# EAGLE schematic main (EAGLE 6.3)
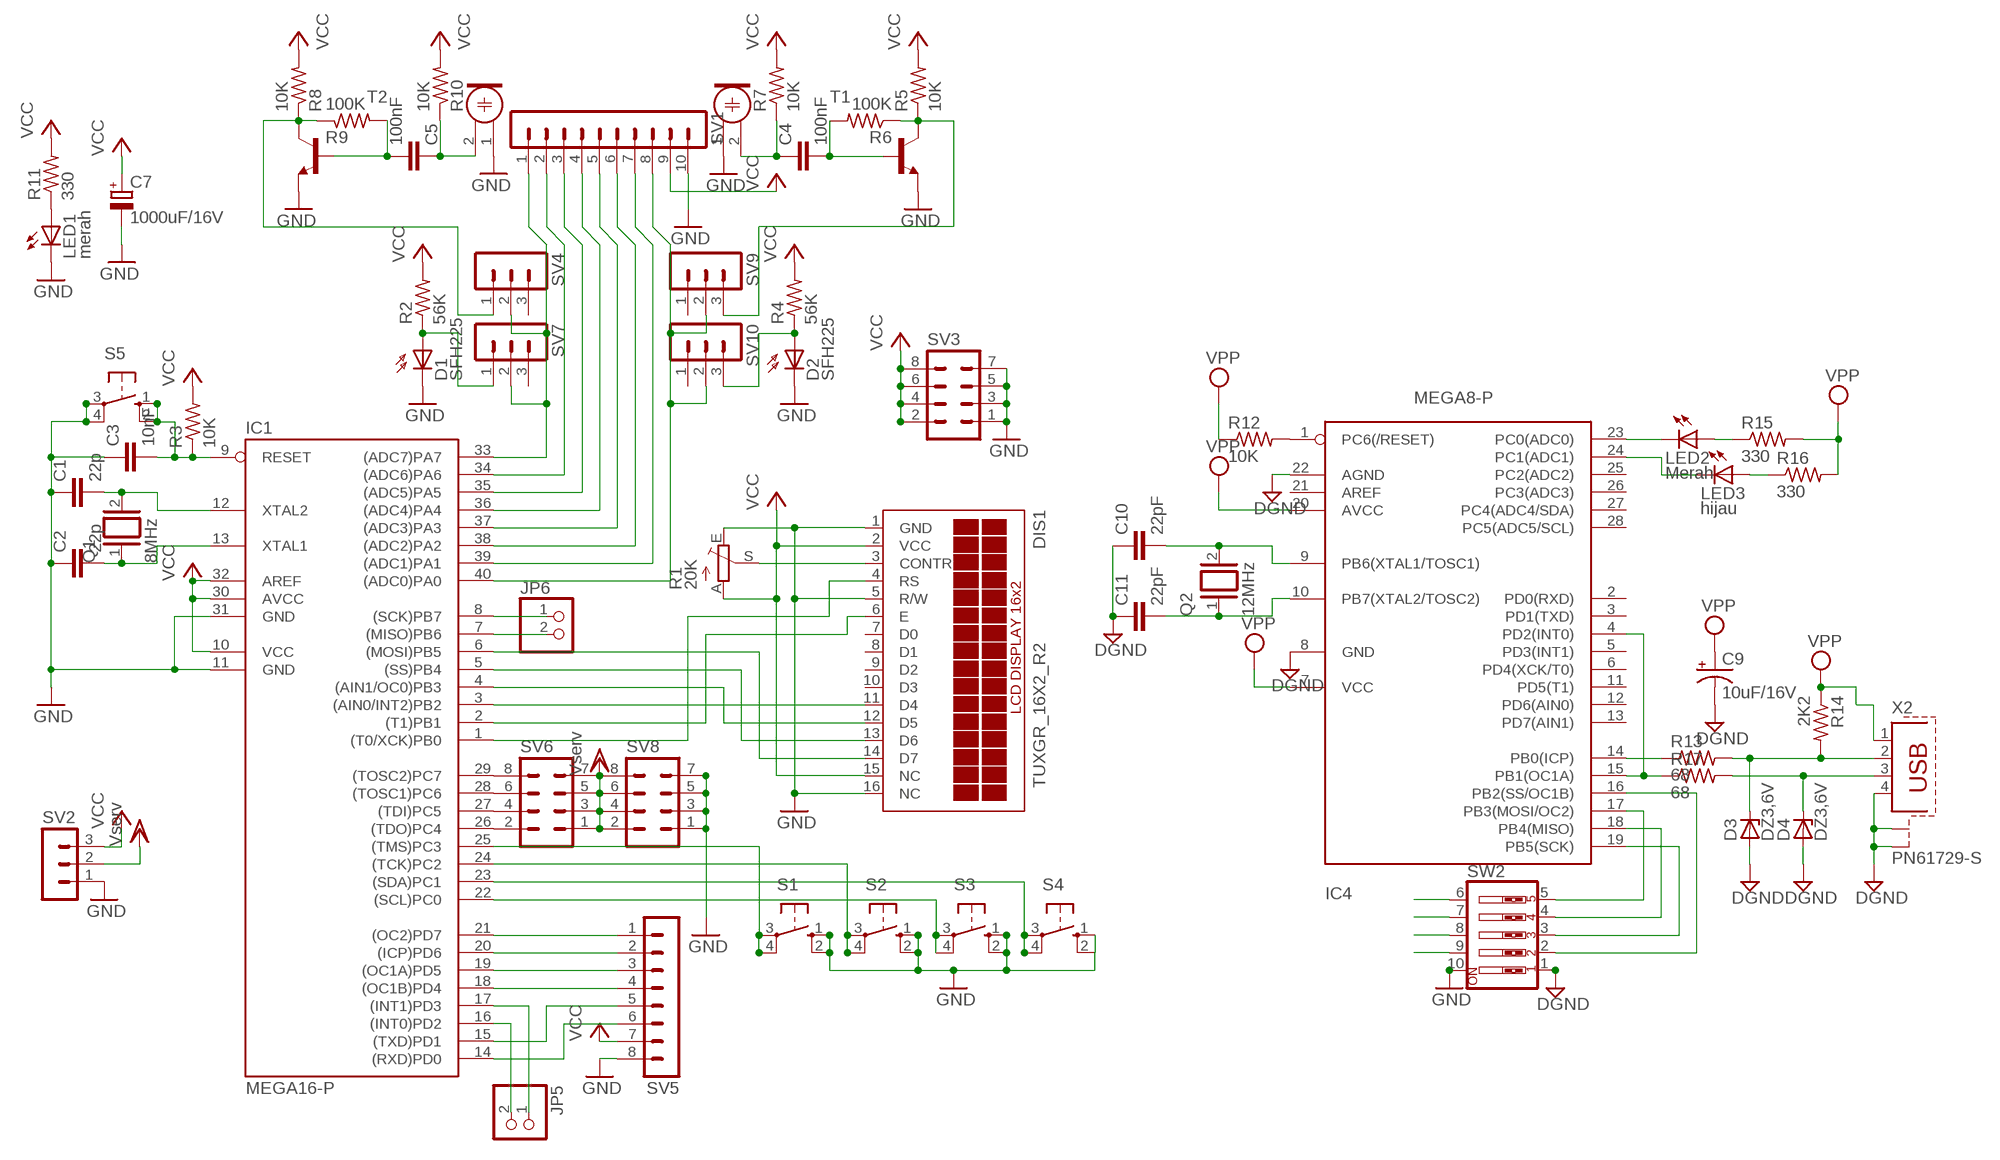
[diagram p0: schematic, sheet 1]

## Parts
C1  22p  C2,5-3  [C2.5-3]
C2  22p  C2,5-3  [C2.5-3]
C3  10nF  C2,5-3  [C2.5-3]
C4  100nF  C2,5-3  [C2.5-3]
C5  100nF  C2,5-3  [C2.5-3]
C7  1000uF/16V  CPOL-EUE5-10.5  [E5-10,5]
C9  10uF/16V  CPOL-USE2.5-5  [E2,5-5]
C10  22pF  C-EU025-024X044  [C025-024X044]
C11  22pF  C-EU025-024X044  [C025-024X044]
D1  SFH225  [SFH225]
D2  SFH225  [SFH225]
D3  DZ3,6V  ZENER-DIODEZD-5  [ZDIO-5]
D4  DZ3,6V  ZENER-DIODEZD-5  [ZDIO-5]
DIS1  TUXGR_16X2_R2  [TUXGR_16X2_R2]
IC1  MEGA16-P  [DIL40]
IC4  MEGA8-P  [DIL28-3]
JP5  PINHD-1X2  [1X02]
JP6  PINHD-1X2  [1X02]
LED1  merah  LED3MM  [LED3MM]
LED2  Merah  LED3MM  [LED3MM]
LED3  hijau  LED3MM  [LED3MM]
MICL  MC  ELECTRET_MICROPHON-F6050AP  [F6050AP]
MICR  MC  ELECTRET_MICROPHON-F6050AP  [F6050AP]
Q1  8MHz  XTAL/S  [QS]
Q2  12MHz  XTAL/S  [QS]
R1  20K  TRIM_EU-CA6V  [CA6V]
R2  56K  R-US_0207/10  [0207/10]
R3  10K  R-US_0207/10  [0207/10]
R4  56K  R-US_0207/10  [0207/10]
R5  10K  R-US_0207/10  [0207/10]
R6  100K  R-US_0207/10  [0207/10]
R7  10K  R-US_0207/10  [0207/10]
R8  10K  R-US_0207/10  [0207/10]
R9  100K  R-US_0207/10  [0207/10]
R10  10K  R-US_0207/10  [0207/10]
R11  330  R-US_0207/10  [0207/10]
R12  10K  R-US_0207/10  [0207/10]
R13  68  R-US_0207/10  [0207/10]
R14  2K2  R-US_0207/10  [0207/10]
R15  330  R-US_0207/10  [0207/10]
R16  330  R-US_0207/10  [0207/10]
R17  68  R-US_0207/10  [0207/10]
S1  10-XX  [B3F-10XX]
S2  10-XX  [B3F-10XX]
S3  10-XX  [B3F-10XX]
S4  10-XX  [B3F-10XX]
S5  10-XX  [B3F-10XX]
SV1  MA10-1  [MA10-1]
SV2  MA03-1  [MA03-1]
SV3  MA04-2  [MA04-2]
SV4  MA03-1  [MA03-1]
SV5  MA08-1W  [MA08-1W]
SV6  MA04-2  [MA04-2]
SV7  MA03-1  [MA03-1]
SV8  MA04-2  [MA04-2]
SV9  MA03-1  [MA03-1]
SV10  MA03-1  [MA03-1]
SW2  SW_DIP-5  [EDG-05]
T1  -NPN-TO92-EBC  [TO92-EBC]
T2  -NPN-TO92-EBC  [TO92-EBC]
X2  PN61729-S  [PN61729-S]

## Nets
DGND: C9.- C10.1 C11.1 D3.A D4.A IC4.8(GND) IC4.22(AGND) SW2.1 X2.4 X2.S1 X2.S2
GND: C1.1 C2.1 C3.1 C7.- D1.K(C) D2.K(C) DIS1.1(GND) DIS1.5(R/W) DIS1.16(NC) IC1.11(GND) IC1.31(GND) LED1.K(C) MICL.1 MICR.1 R1.E S1.1(S) S1.2(S1) S2.1(S) S2.2(S1) S3.1(S) S3.2(S1) S4.1(S) S4.2(S1) S5.3(P) S5.4(P1) SV1.10 SV2.1 SV3.1 SV3.3 SV3.5 SV3.7 SV5.8 SV8.1 SV8.3 SV8.5 SV8.7 SW2.10 T1.E T2.E
MISO: IC1.7((MISO)PB6) JP6.2 SW2.7
MOSI: DIS1.14(D7) IC1.6((MOSI)PB5) SW2.6
N$1: IC1.33((ADC7)PA7) SV1.1 SV4.2 SV7.2
N$2: IC1.34((ADC6)PA6) SV1.2
N$3: IC1.35((ADC5)PA5) SV1.3
N$4: IC1.36((ADC4)PA4) SV1.4
N$5: IC1.37((ADC3)PA3) SV1.5
N$6: IC1.38((ADC2)PA2) SV1.6
N$7: IC1.39((ADC1)PA1) SV1.7
N$8: D2.A R4.1 SV10.3
N$9: IC1.24((TCK)PC2) S2.3(P) S2.4(P1)
N$10: DIS1.13(D6) IC1.5((SS)PB4)
N$11: DIS1.12(D5) IC1.4((AIN1/OC0)PB3)
N$12: DIS1.11(D4) IC1.3((AIN0/INT2)PB2)
N$13: DIS1.6(E) IC1.2((T1)PB1)
N$14: R5.1 R6.1 SV9.3 T1.C
N$15: DIS1.3(CONTR) R1.S
N$16: C1.2 IC1.12(XTAL2) Q1.2
N$17: C2.2 IC1.13(XTAL1) Q1.1
N$18: DIS1.4(RS) IC1.1((T0/XCK)PB0)
N$19: D1.A R2.1 SV7.1
N$20: IC1.23((SDA)PC1) S4.3(P) S4.4(P1)
N$21: IC1.40((ADC0)PA0) SV1.8 SV9.2 SV10.2
N$22: C4.2 R6.2 T1.B
N$23: C4.1 MICL.2 R7.1
N$24: R8.1 R9.1 SV4.1 T2.C
N$25: C5.2 R9.2 T2.B
N$26: C5.1 MICR.2 R10.1
N$27: IC1.22((SCL)PC0) S3.3(P) S3.4(P1)
N$28: IC1.25((TMS)PC3) S1.3(P) S1.4(P1)
N$30: IC1.21((OC2)PD7) SV5.1
N$32: IC1.20((ICP)PD6) SV5.2
N$33: IC1.19((OC1A)PD5) SV5.3
N$34: IC1.18((OC1B)PD4) SV5.4
N$35: IC1.15((TXD)PD1) SV5.5
N$36: IC1.14((RXD)PD0) SV5.6
N$37: IC1.16((INT0)PD2) JP5.2
N$38: IC1.17((INT1)PD3) JP5.1
N$41: LED1.A R11.1
N$42: IC4.1(PC6(/RESET)) R12.2
N$44: IC1.26((TDO)PC4) SV6.2
N$45: IC1.27((TDI)PC5) SV6.4
N$46: IC1.28((TOSC1)PC6) SV6.6
N$47: IC1.29((TOSC2)PC7) SV6.8
N$51: C10.2 IC4.9(PB6(XTAL1/TOSC1)) Q2.2
N$52: C11.2 IC4.10(PB7(XTAL2/TOSC2)) Q2.1
N$53: IC4.14(PB0(ICP)) R13.1
N$55: LED2.A R15.1
N$56: LED3.A R16.1
N$57: IC4.23(PC0(ADC0)) LED2.K(C)
N$58: IC4.24(PC1(ADC1)) LED3.K(C)
N$59: D4.C R17.2 X2.3
N$67: IC4.4(PD2(INT0)) IC4.15(PB1(OC1A)) R17.1
N$69: D3.C R13.2 R14.2 X2.2
N$175: IC4.17(PB3(MOSI/OC2)) SW2.5
N$176: IC4.18(PB4(MISO)) SW2.4
N$177: IC4.19(PB5(SCK)) SW2.3
N$178: IC4.16(PB2(SS/OC1B)) SW2.2
RESET: C3.2 IC1.9(RESET) R3.1 S5.1(S) S5.2(S1) SW2.9
SCK: IC1.8((SCK)PB7) JP6.1 SW2.8
VCC: C7.+ DIS1.2(VCC) DIS1.15(NC) IC1.10(VCC) IC1.30(AVCC) IC1.32(AREF) R1.A R2.2 R3.2 R4.2 R5.2 R7.2 R8.2 R10.2 R11.2 SV1.9 SV2.3 SV3.2 SV3.4 SV3.6 SV3.8 SV5.7
VDD: SV2.2 SV6.1 SV6.3 SV6.5 SV6.7 SV8.2 SV8.4 SV8.6 SV8.8 ; supply symbol labelled Vserv
VPP: C9.+ IC4.7(VCC) IC4.20(AVCC) R12.1 R14.1 R15.2 R16.2 X2.1
Unconnected: DIS1.7(D0) DIS1.8(D1) DIS1.9(D2) DIS1.10(D3) IC4.2(PD0(RXD)) IC4.3(PD1(TXD)) IC4.5(PD3(INT1)) IC4.6(PD4(XCK/T0)) IC4.11(PD5(T1)) IC4.12(PD6(AIN0)) IC4.13(PD7(AIN1)) IC4.21(AREF) IC4.25(PC2(ADC2)) IC4.26(PC3(ADC3)) IC4.27(PC4(ADC4/SDA)) IC4.28(PC5(ADC5/SCL)) SV4.3 SV7.3 SV9.1 SV10.1

## Library data of the parts
C1-C5 = capacitor-wima:C: CAPACITOR naming: grid - package width
C7 = rcl:CPOL-EU: POLARIZED CAPACITOR, European symbol
C9 = rcl:CPOL-US: POLARIZED CAPACITOR, American symbol
C10 C11 = rcl:C-EU: CAPACITOR, European symbol
D1 D2 = opto-trans-siemens:SFH225: PHOTO DIODE; OC_FARNELL: unknown; OC_NEWARK: unknown
D3 D4 = diode:ZENER-DIODE: Z-Diode
DIS1 = display-lcd:TUXGR_16X2_R2: Tuxgraphics LCD display 16x2 characters reflective, without background light Source: tuxgr_12x2_r2.pdf; OC_FARNELL: unknown; OC_NEWARK: unknown
IC1 = atmel:MEGA16-P: MICROCONTROLLER 16 Kbytes FLASH 1 kbytes SRAM 512 bytes EEPROM USART 8-channel 10 bit ADC Source: avr.lbr; MPN: ATMEGA16-16PU; OC_FARNELL: 9171142; OC_NEWARK: 01M6885
IC4 = atmel:MEGA8-P: MICROCONTROLLER 8 Kbytes FLASH, 1 kbytes SRAM, 512 bytes EEPROM, USART, 4-channel 10 bit ADC, 2-channel 8 bit ADC Pin compatible with Atmega48, ATMega88, ATMega168 Source: avr.lbr
JP5 JP6 = pinhead:PINHD-1X2: PIN HEADER
LED1-LED3 = led:LED: LED OSRAM: - CHIPLED LG R971, LG N971, LY N971, LG Q971, LY Q971, LO R971, LY R971 LH N974, LH R974 LS Q976, LO Q976, LY Q976 LO Q996 - Hyper CHIPLED LW Q18S LB Q993, LB Q99A, LB R99A - SideLED LS A670, LO A670, LY A670, LG A670, LP A670 LB A673, LV A673, LT A673, LW A673 LH A674 LY A675 LS A676, LA A676, LO A676, LY A676, LW A676 LS A679, LY A679, LG A679 - Hyper Micro SIDELED® LS Y876, LA Y876, LO Y876, LY Y876 LT Y87S - SmartLED LW L88C, LW L88S LB L89C, LB L89S, LG L890 LS L89K, LO L89K, LY L89K LS L896, LA L896, LO L896, LY L896 - TOPLED LS T670, LO T670, LY T670, LG T670, LP T670 LSG T670, LSP T670, LSY T670, LOP T670, LYG T670 LG T671, LOG T671, LSG T671 LB T673, LV T673, LT T673, LW T673 LH T674 LS T676, LA T676, LO T676, LY T676, LB T676, LH T676, LSB T676, LW T676 LB T67C, LV T67C, LT T67C, LS T67K, LO T67K, LY T67K, LW E67C LS E67B, LA E67B, LO E67B, LY E67B, LB E67C, LV E67C, LT E67C LW T67C LS T679, LY T679, LG T679 LS T770, LO T770, LY T770, LG T770, LP T770 LB T773, LV T773, LT T773, LW T773 LH T774 LS E675, LA E675, LY E675, LS T675 LS T776, LA T776, LO T776, LY T776, LB T776 LHGB T686 LT T68C, LB T68C - Hyper Mini TOPLED® LB M676 - Mini TOPLED Santana® LG M470 LS M47K, LO M47K, LY M47K Source: http://www.osram.convergy.de LUXEON: - LUMILED® LXK2-PW12-R00, LXK2-PW12-S00, LXK2-PW14-U00, LXK2-PW14-V00 LXK2-PM12-R00, LXK2-PM12-S00, LXK2-PM14-U00 LXK2-PE12-Q00, LXK2-PE12-R00, LXK2-PE12-S00, LXK2-PE14-T00, LXK2-PE14-U00 LXK2-PB12-K00, LXK2-PB12-L00, LXK2-PB12-M00, LXK2-PB14-N00, LXK2-PB14-P00, LXK2-PB14-Q00 LXK2-PR12-L00, LXK2-PR12-M00, LXK2-PR14-Q00, LXK2-PR14-R00 LXK2-PD12-Q00, LXK2-PD12-R00, LXK2-PD12-S00 LXK2-PH12-R00, LXK2-PH12-S00 LXK2-PL12-P00, LXK2-PL12-Q00, LXK2-PL12-R00 Source: www.luxeon.com KINGBRIGHT: KA-3528ASYC Source: www.kingbright.com
MICL MICR = microphon:ELECTRET_MICROPHON-: Electret Condenser Microphone
Q1 Q2 = special:XTAL/S: CRYSTAL
R1 = pot:TRIM_EU-: POTENTIOMETER
R2-R11 = rcl:R-US_: RESISTOR, American symbol
R12-R17 = resistor:R-US_: RESISTOR, American symbol
S1-S5 = switch-omron:10-XX: OMRON SWITCH; MPN: B3F-1000; OC_FARNELL: 176432; OC_NEWARK: 36M3542
SV1 = con-lstb:MA10-1: PIN HEADER; OC_FARNELL: unknown; OC_NEWARK: unknown
SV2 SV4 SV7 SV9 SV10 = con-lstb:MA03-1: PIN HEADER; OC_FARNELL: unknown; OC_NEWARK: unknown
SV3 SV6 SV8 = con-lstb:MA04-2: PIN HEADER; OC_FARNELL: unknown; OC_NEWARK: unknown
SV5 = con-lstb:MA08-1W: PIN HEADER; OC_FARNELL: unknown; OC_NEWARK: unknown
SW2 = special:SW_DIP-5: DIP SWITCH
T1 T2 = transistor:*-NPN-: NPN Transistror BF959 corrected 2008.03.06
X2 = con-berg:PN61729-S: BERG USB connector